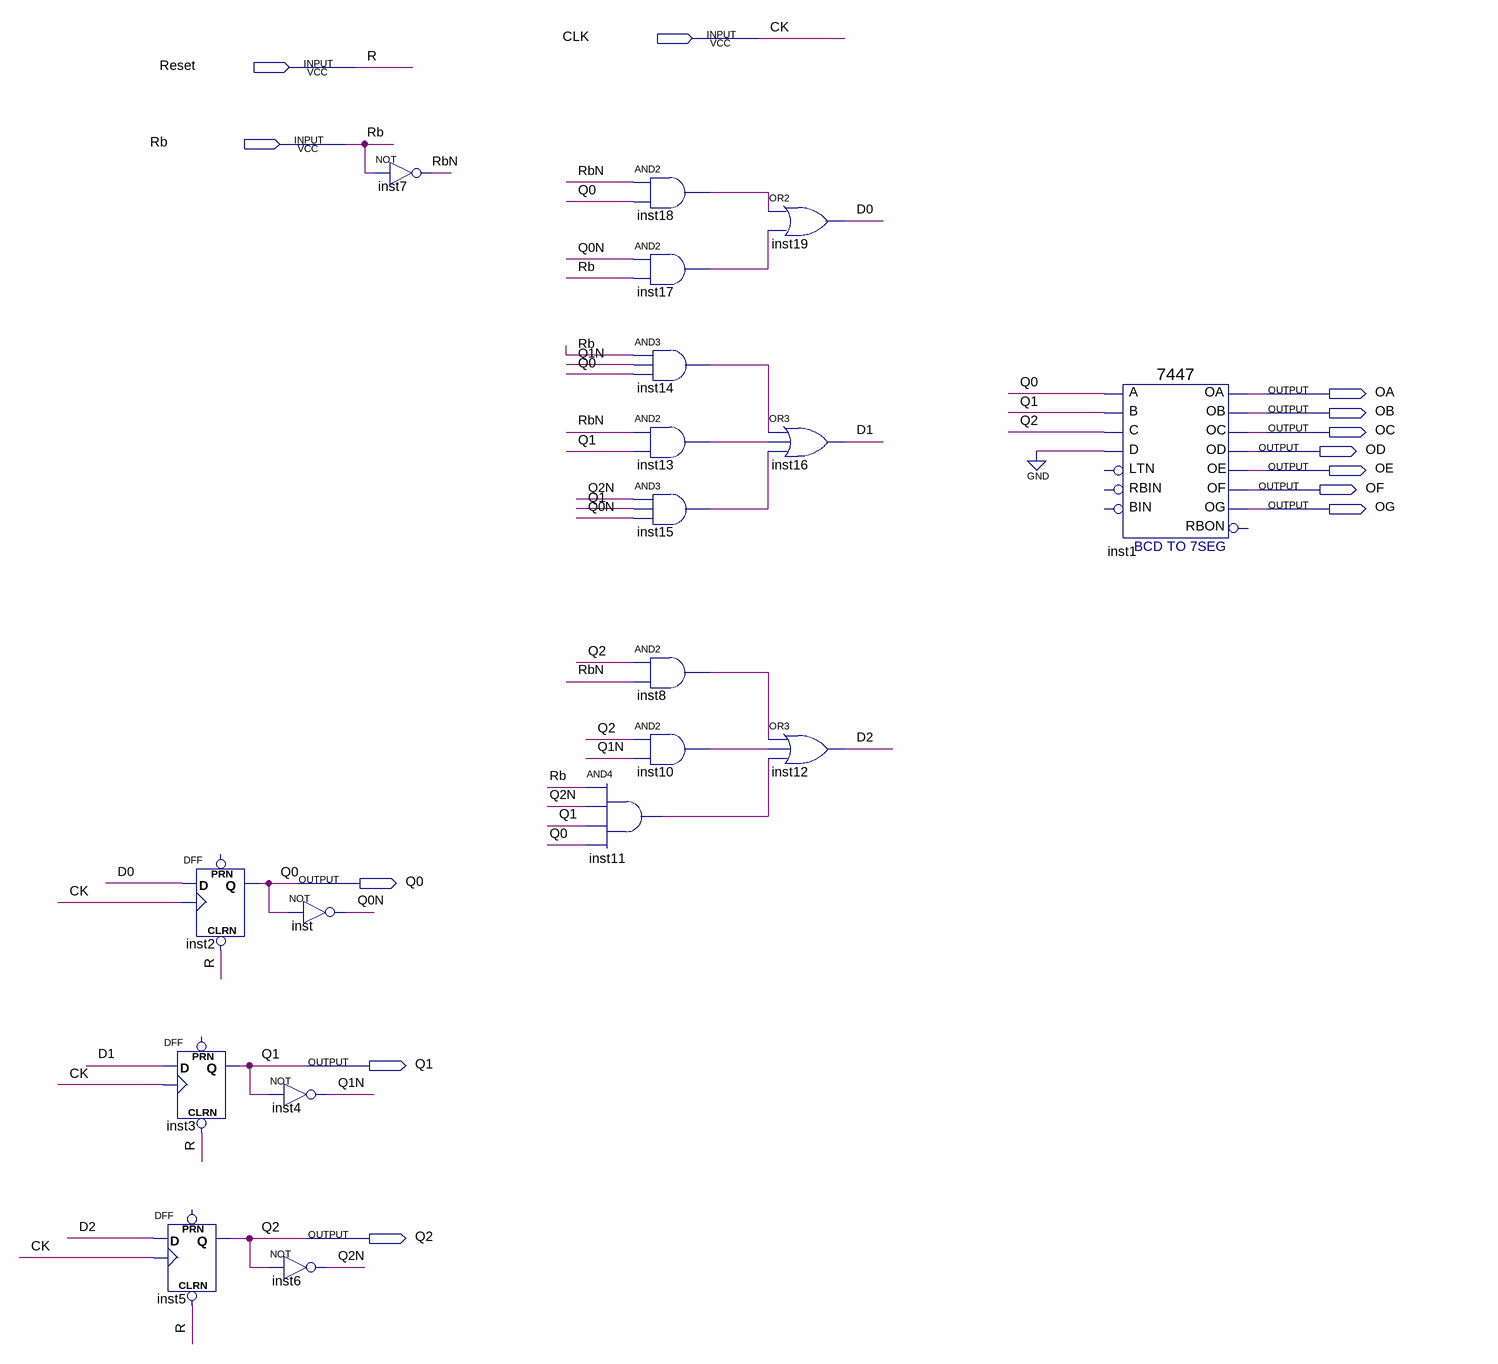
[diagram p0: schematic sheet]
// Quartus schematic rolldice.bdf as structural Verilog: 19 symbols, 13 pins
module rolldice (
  input  CLK,
  input  Reset,
  input  Rb,
  output OA,
  output OB,
  output OC,
  output OD,
  output OE,
  output OF,
  output OG,
  output Q0,
  output Q1,
  output Q2
);

  wire D0, D1, D2, inst8_out, inst10_out, inst11_out, inst13_out, inst14_out, inst15_out, inst17_out,
       inst18_out, Q0N, Q1N, Q2N, RbN;

  DFF inst5 (.CLRN(Reset), .CLK(CLK), .D(D2), .Q(Q2));  // open: PRN
  DFF inst2 (.CLRN(Reset), .CLK(CLK), .D(D0), .Q(Q0));  // open: PRN
  DFF inst3 (.CLRN(Reset), .CLK(CLK), .D(D1), .Q(Q1));  // open: PRN
  not inst (Q0N, Q0);
  not inst4 (Q1N, Q1);
  not inst6 (Q2N, Q2);
  not inst7 (RbN, Rb);
  and inst11 (inst11_out, Rb, Q2N, Q1, Q0);
  and inst18 (inst18_out, RbN, Q0);
  and inst17 (inst17_out, Q0N, Rb);
  and inst14 (inst14_out, Rb, Q1N, Q0);
  and inst13 (inst13_out, RbN, Q1);
  and inst15 (inst15_out, Q2N, Q1, Q0N);
  and inst8 (inst8_out, Q2, RbN);
  and inst10 (inst10_out, Q2, Q1N);
  or inst19 (D0, inst18_out, inst17_out);
  or inst16 (D1, inst14_out, inst13_out, inst15_out);
  or inst12 (D2, inst8_out, inst10_out, inst11_out);
  \7447  inst1 (
    .B(Q1), .C(Q2), .D(1'b0), .A(Q0), .OB(OB), .OC(OC), .OE(OE), .OD(OD), .OF(OF), .OG(OG), .OA(OA));  // open: LTN, RBIN, BIN, RBON

  // Other names for the same wires on the sheet: CK = CLK; R = Reset
endmodule
